# Altium project Power_Regulator_LED_Board.PrjPcb
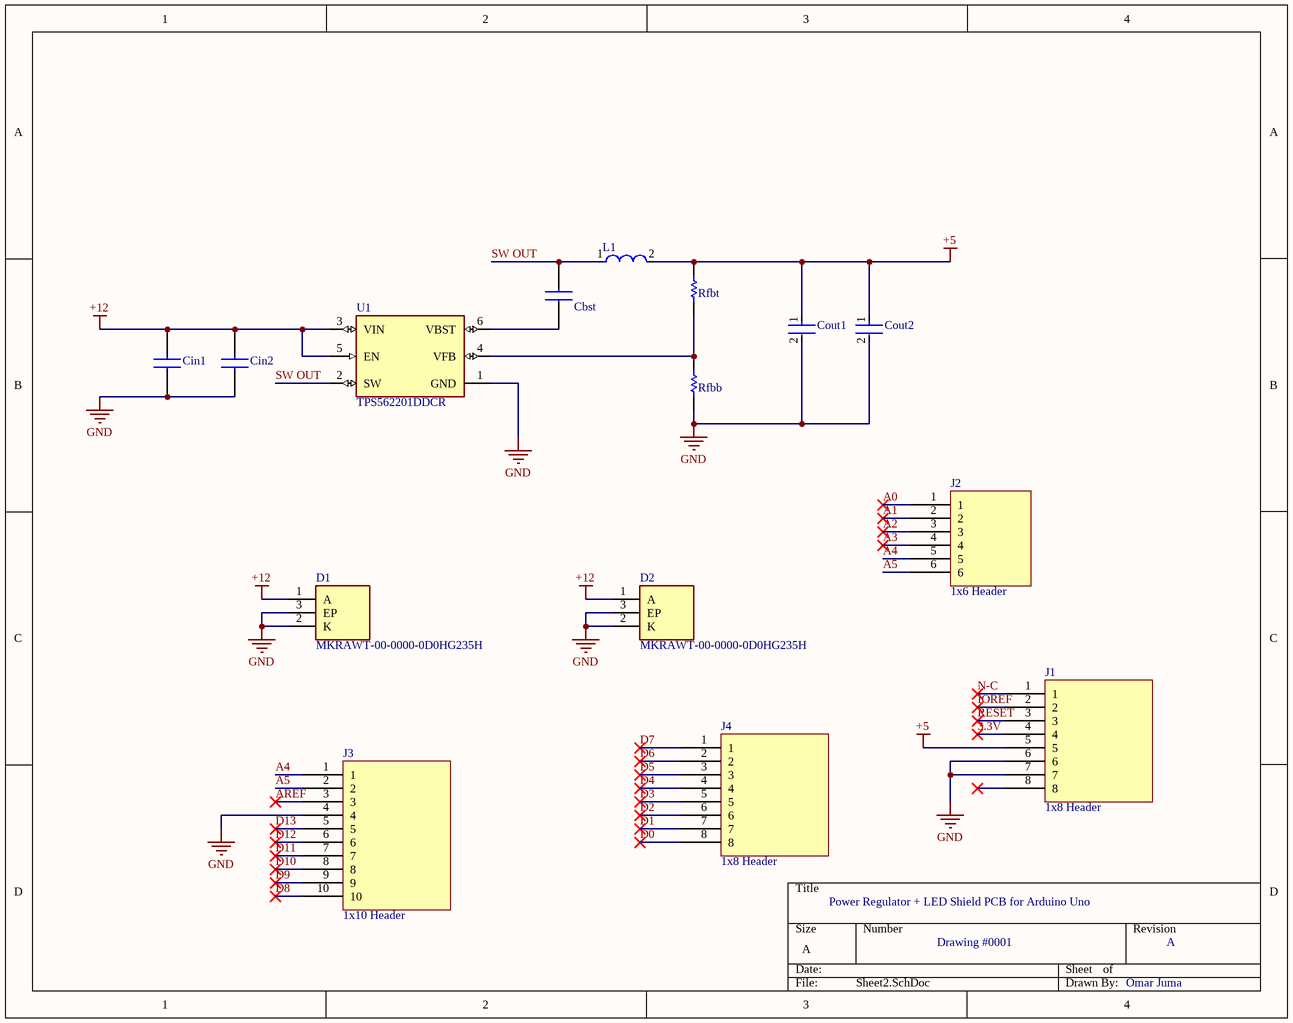
[diagram p0: Sheet2.SchDoc]
1 sheet, 15 parts. Net scope: global (net labels, ports and power ports of the same name join across sheets).
Board file: PCB1.PcbDoc

## Sheet Sheet2.SchDoc
size A; SheetNumber: 1; SheetTotal: 1

### Parts
Cbst  08053C104KAT2A  [CAPC2012X94N]  (value not drawn)
Cin1  MSAST219LB5106KTNA01  [CAPC2114X95N]  (value not drawn)
Cin2  MSAST219LB5106KTNA01  [CAPC2114X95N]  (value not drawn)
Cout1  GRM21BR61A226ME44L  [FP-GRM21B-0_2-e0_2_0_7-IPC_C]  (value not drawn)
Cout2  GRM21BR61A226ME44L  [FP-GRM21B-0_2-e0_2_0_7-IPC_C]  (value not drawn)
D1  MKRAWT-00-0000-0D0HG235H  [MKRAWT0000000D0HG235H]
D2  MKRAWT-00-0000-0D0HG235H  [MKRAWT0000000D0HG235H]
J1  1x8 Header  [1x8 Header]
J2  1x6 Header  [1x6 Header]
J3  1x10 Header  [1x10 Header]
J4  1x8 Header  [1x8 Header]
L1  NRS8030T3R3MJGJ  [FP-NRS8030-MFG]  (value not drawn)
Rfbb  ERJ2RKF1002X  [RESC1005X40X25LL05T05]  (value not drawn)
Rfbt  CRCW020156K2FNED  [RESC0603X28X15NL05T05]  (value not drawn)
U1  TPS562201DDCR  [FP-DDC0006A-IPC_C]

### Nets
+5: Cout1.1 Cout2.1 J1.5 L1.2 Rfbt.2
+12: Cin1.2 Cin2.2 D1.1(A) D2.1(A) U1.3(VIN) U1.5(EN)
GND: Cin1.1 Cin2.1 Cout1.2 Cout2.2 D1.2(K) D1.3(EP) D2.2(K) D2.3(EP) J1.6 J1.7 J3.4 Rfbb.1 U1.1(GND)
3.3V: J1.4
A0: J2.1
A1: J2.2
A2: J2.3
A3: J2.4
A4: J2.5 J3.1
A5: J2.6 J3.2
AREF: J3.3
D0: J4.8
D1: J4.7
D2: J4.6
D3: J4.5
D4: J4.4
D5: J4.3
D6: J4.2
D7: J4.1
D8: J3.10
D9: J3.9
D10: J3.8
D11: J3.7
D12: J3.6
D13: J3.5
IOREF: J1.2
N-C: J1.1
RESET: J1.3
SW OUT: Cbst.2 L1.1 U1.2(SW)
NetCbst_1: Cbst.1 U1.6(VBST)
NetRfbb_2: Rfbb.2 Rfbt.1 U1.4(VFB)

Not connected (* = marked no-connect by the designer): J1 8*

### Notes on the sheet
- Power Regulator + LED Shield PCB for Arduino Uno
- Drawing #0001
- A
- Omar Juma

### Library data of the parts
Cbst = 08053C104KAT2A: 0805 X7R ceramic capacitor, 25V 0.1uF AVX 0805 Standard 100nF Ceramic Multilayer Capacitor, 25 V dc X7R Dielectric  /-10% SMD; Manufacturer_Name: Kyocera AVX; Geometry.Height: 0.94mm; Farnell Part Number: *; Farnell Price/Stock: *; Manufacturer_Part_Number: 08053C104KAT2A; Datasheet Link: http://datasheets.avx.com/X7RDielectric.pdf
Cin1 Cin2 = MSAST219LB5106KTNA01: Multilayer Ceramic Capacitors MLCC - SMD/SMT 25V 10uF X5R 0805 10%; Manufacturer_Name: TAIYO YUDEN; Geometry.Height: 0.95mm; Mouser Part Number: *; Mouser Price/Stock: *; Manufacturer_Part_Number: MSAST219LB5106KTNA01; Datasheet Link: https://4donline.ihs.com/images/VipMasterIC/IC/TAIY/TAIY-S-A0026212580/TAIY-S-A0026217264-1.pdf?hkey=61A2E4C270F0397D049F8F05BD4F1054
Cout1 Cout2 = CMP-06035-039918-1: Chip Multilayer Ceramic Capacitors for General Purpose, 0805, 22uF, X5R, 15%, 20%, 10V; Dissipation Factor: 0.035%; Min Operating Temperature: -55°C; Voltage Rating (DC): 10V; Height: 1.25mm; Depth: 1.25mm; Max Operating Temperature: 85°C; Width: 1.25mm; Lead Free: Lead Free; Dielectric Material: Ceramic; Weight: 0.000335oz; Tolerance: 20%; Voltage Rating: 10V; Case Code (Metric): 2012; Termination: SMD/SMT; Length: 2mm; Thickness: 0.057inch; Case/Package: 0805; Packaging: Tape and Reel; Voltage: 10V; Case Code (Imperial): 0805; Resistor Type: Ceramic; Package Quantity: 3000; Mount: Surface Mount; Capacitance: 22uF; Dielectric: X5R
D1 D2 = MKRAWT-00-0000-0D0HG235H: LED Uni-Color White 3500K 80 2-Pin SMD EP T/R; Manufacturer_Name: CREE LED; Geometry.Height: 4.21mm; Mouser Part Number: 941-MKRAWT0D0HG235H; Mouser Price/Stock: https://www.mouser.co.uk/ProductDetail/Cree-LED/MKRAWT-00-0000-0D0HG235H?qs=TqB%2FzLOUcHLtwo74coesIQ%3D%3D; Manufacturer_Part_Number: MKRAWT-00-0000-0D0HG235H; Datasheet Link: https://www.digikey.com/en/products/detail/cree-led/MKRAWT-00-0000-0D0HG235H/4437229
L1 = CMP-14484-000405-1: Inductor Power Shielded Wirewound 3.3uH 20% 100KHz Ferrite 4.2A 24.7mΩ DCR T/R; Current Rating: 4.3A; DC Resistance (DCR): 19mR; Self Resonant Frequency: 50MHz; Height: 3mm; Lead Free: Lead Free; Saturation Current: 4.2A; Termination: SMD/SMT; RoHS Compliant: Yes; Resistor Type: Wirewound; RMS Current (Irms): 4.3A; Series: NRS; Halogen Free: Halogen Free; Shielding: Shielded; Length: 8mm; Max DC Current: 4.2A; Height - Seated (Max): 0.118inch; Radiation Hardening: No; Min Operating Temperature: -25°C; Number of Pins: 2; Core Material: Ferrite; Inductance: 3.3uH; Package Quantity: 1000; REACH SVHC: No SVHC; Test Frequency: 100kHz; Tolerance: 20%; Case/Package: Nonstandard; Inductance Tolerance: 20%; Width: 0.315inch; Mount: Surface Mount; Depth: 8.2mm; Lead Pitch: 5.6mm; Packaging: Tape and Reel; Max Operating Temperature: 125°C
Rfbb = CMP-2000-07588-1: Chip Resistor, 10 KOhm, +/- 1%, 0.1 W, -55 to 155 degC, 0402 (1005 Metric), RoHS, Tape and Reel; Manufacturer: Panasonic; Power Rating: 100mW; Voltage Rating: 50V; Resistance: 10KOhm; Case\/Package: 0402; Temperature Coefficient: 100ppm\/degreesC; RoHSCompliant: True; Lead Free: LeadFree; Package Quantity: 1; Contact Plating: Tin; Length: 1mm; Radiation Hardening: No; REACH SVHC: NoSVHC; Max Operating Temperature: 155degC; Depth: 0.5mm; Case Code (Imperial): 0402; Military Standard: Not; Package Description: 2-Pin Surface Mount Device, Body 1 x 0.5 mm; Termination: SMD/SMT; Case Code (Metric): 1005; Height: 0.35mm; Packaging: TapeandReel; Voltage Rating (DC): 50V; Package Reference: 402; Number of Pins: 2; Tolerance: 1%; Mounting Technology: SurfaceMount; Width: 0.02inch; Mount: SurfaceMount; Datasheet URL: https://industrial.panasonic.com/cdbs/www-data/pdf/RDA0000/AOA0000C304.pdf; Composition: ThickFilm; Datasheet Version: 02/2017; Manufacturer URL: http://www.panasonic.com/; Max Power Dissipation: 100mW; Number of Terminations: 2; Min Operating Temperature: -55degC
Rfbt = CMP-2004-00723-1: Manufacturer: Vishay Dale; Part Number: CRCW020156K2FNED
U1 = CMP-04918-000361-1: IC REG BUCK ADJ 2A TSOT23-6; Switching Frequency: 580kHz; Max Input Voltage: 17V; Number of Outputs: 1; Output Voltage: 7V; Output Type: Adjustable; Quiescent Current: 400uA; Min Input Voltage: 4.5V; Mount: Surface Mount; Max Operating Temperature: 125°C; Lead Free: Lead Free; Operating Supply Voltage: 17V; Number of Pins: 6; RoHS Compliant: Yes; Contact Plating: Tin; Min Operating Temperature: -40°C; Case/Package: SOT; Max Output Current: 2A